# Altium schematic sheet Maxim.SchDoc
size A
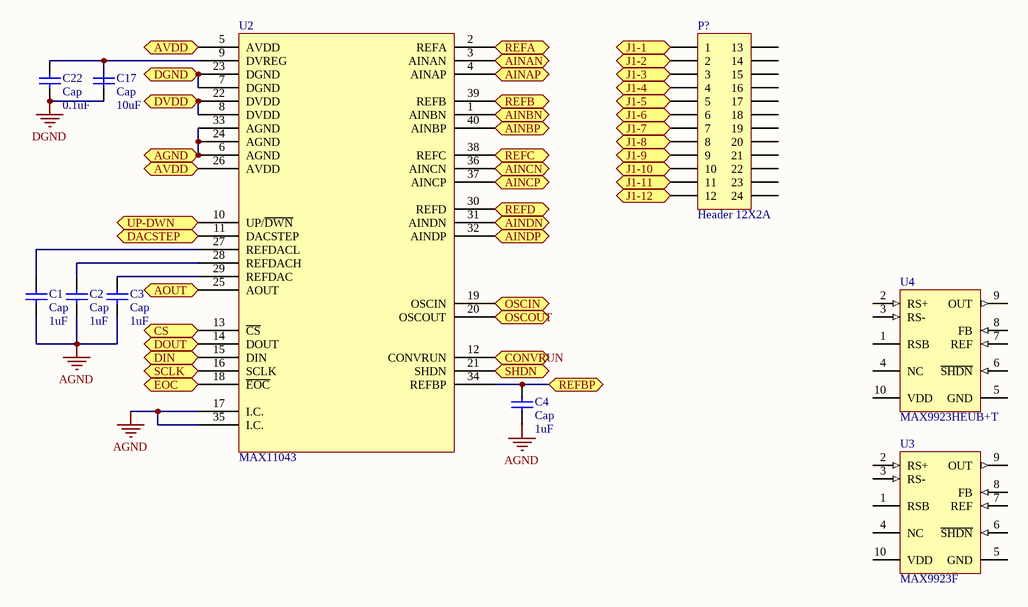
[diagram p0: Maxim.SchDoc]

## Parts
C1  Cap  value 1uF  [RAD-0.3]
C2  Cap  value 1uF  [RAD-0.3]
C3  Cap  value 1uF  [RAD-0.3]
C4  Cap  value 1uF  [RAD-0.3]
C17  Cap  value 10uF  [RAD-0.3]
C22  Cap  value 0.1uF  [RAD-0.3]
P?  Header 12X2A  [HDR2X12_CEN]
U2  MAX11043
U3  MAX9923F  [MAXM-U10+2_N]
U4  MAX9923HEUB+T  [MAXM-U10+2_N]

## Ports
AGND, AINAN, AINAP, AINBN, AINBP, AINCN, AINCP, AINDN, AINDP, AOUT, AVDD, CONVRUN, CS, DACSTEP, DGND, DIN, DOUT, DVDD, EOC, J1-1, J1-2, J1-3, J1-4, J1-5, J1-6, J1-7, J1-8, J1-9, J1-10, J1-11, J1-12, OSCIN, OSCOUT, REFA, REFB, REFBP, REFC, REFD, SCLK, SHDN, UP-DWN

## Nets
AGND: C1.1 C2.2 C3.1 C4.2 U2.17(I.C.) U2.35(I.C.)
DGND: C17.2 C22.2
AGND: U2.6(AGND) U2.24(AGND) U2.33(AGND) ; port AGND  [a separate net that carries the same name]
AINAN: U2.3(AINAN) ; port AINAN
AINAP: U2.4(AINAP) ; port AINAP
AINBN: U2.1(AINBN) ; port AINBN
AINBP: U2.40(AINBP) ; port AINBP
AINCN: U2.36(AINCN) ; port AINCN
AINCP: U2.37(AINCP) ; port AINCP
AINDN: U2.31(AINDN) ; port AINDN
AINDP: U2.32(AINDP) ; port AINDP
AOUT: U2.25(AOUT) ; port AOUT
AVDD: U2.5(AVDD) U2.26(AVDD) ; port AVDD
CONVRUN: U2.12(CONVRUN) ; port CONVRUN
CS: U2.13(~{CS}) ; port CS
DACSTEP: U2.11(DACSTEP) ; port DACSTEP
DGND: U2.7(DGND) U2.23(DGND) ; port DGND  [a separate net that carries the same name]
DIN: U2.15(DIN) ; port DIN
DOUT: U2.14(DOUT) ; port DOUT
DVDD: U2.8(DVDD) U2.22(DVDD) ; port DVDD
EOC: U2.18(~{EOC}) ; port EOC
J1-1: P?.1 ; port J1-1
J1-2: P?.2 ; port J1-2
J1-3: P?.3 ; port J1-3
J1-4: P?.4 ; port J1-4
J1-5: P?.5 ; port J1-5
J1-6: P?.6 ; port J1-6
J1-7: P?.7 ; port J1-7
J1-8: P?.8 ; port J1-8
J1-9: P?.9 ; port J1-9
J1-10: P?.10 ; port J1-10
J1-11: P?.11 ; port J1-11
J1-12: P?.12 ; port J1-12
OSCIN: U2.19(OSCIN) ; port OSCIN
OSCOUT: U2.20(OSCOUT) ; port OSCOUT
REFA: U2.2(REFA) ; port REFA
REFB: U2.39(REFB) ; port REFB
REFBP: C4.1 U2.34(REFBP) ; port REFBP
REFC: U2.38(REFC) ; port REFC
REFD: U2.30(REFD) ; port REFD
SCLK: U2.16(SCLK) ; port SCLK
SHDN: U2.21(SHDN) ; port SHDN
UP-DWN: U2.10(UP/~{DWN}) ; port UP-DWN
NetC1_2: C1.2 U2.27(REFDACL)
NetC2_1: C2.1 U2.28(REFDACH)
NetC3_2: C3.2 U2.29(REFDAC)
NetC17_1: C17.1 C22.1 U2.9(DVREG)

Not connected (* = marked no-connect by the designer): P? 13 14 15 16 17 18 19 20 21 22 23 24; U3 1(RSB) 2(RS+) 3(RS-) 4(NC) 5(GND) 6(~{SHDN}) 7(REF) 8(FB) 9(OUT) 10(VDD); U4 1(RSB) 2(RS+) 3(RS-) 4(NC) 5(GND) 6(~{SHDN}) 7(REF) 8(FB) 9(OUT) 10(VDD)

## Library data of the parts
C1-C4 C17 C22 = Cap: Capacitor; Published: 8-Jun-2000; LatestRevisionDate: 17-Jul-2002; LatestRevisionNote: Re-released for DXP Platform.; PackageReference: RAD-0.3; Publisher: Altium Limited; PackageDescription: Radial Cap, Thru-Hole; 2 Leads; 0.3 in Pin Spacing
P? = Header 12X2A: Header, 12-Pin, Dual row; LatestRevisionDate: 17-Jul-2002; LatestRevisionNote: Re-released for DXP Platform.; Publisher: Altium Limited
U3 = CMP-0252-00092-1: Ultra-Precision, High-Side Current-Sense Amplifier with Fixed Gain, 100 V / V Gain, -40 to 85 degC, 10-Pin SOP (U10+2), Pb-Free, Tape and Reel; PartNumber: MAX9923HEUB+T; Gain: 25 V/V, 100 V/V ,250 V/V; Bi-Dir. Curr. Sense: Yes; ComponentLink3Description: Package Specification; ComponentLink2Description: Datasheet; ComponentLink1Description: Manufacturer URL; ComponentLink3URL: http://pdfserv.maximintegrated.com/package_dwgs/21-0061.PDF; PackageReference: U10+2; PackageDescription: 10-Pin Micro-MAX, Thin Shrink Small-Outline (U10+2), Body 3 x 3 mm, Pitch 0.5 mm; PackageVersion: Rev. L, 07/2008; Mounting Technology: Surface Mount; ComponentLink2URL: http://datasheets.maximintegrated.com/en/ds/MAX9922-MAX9923.pdf; ComponentLink1URL: http://www.maximintegrated.com/; Code_JEDEC: MO-187; DatasheetVersion: Rev. 1
U4 = CMP-0252-00092-1: Ultra-Precision, High-Side Current-Sense Amplifier with Fixed Gain, 100 V / V Gain, -40 to 85 degC, 10-Pin SOP (U10+2), Pb-Free, Tape and Reel; Gain: 25 V/V, 100 V/V ,250 V/V; Bi-Dir. Curr. Sense: Yes; PartNumber: MAX9923HEUB+T; ComponentLink3Description: Package Specification; ComponentLink2Description: Datasheet; ComponentLink1Description: Manufacturer URL; ComponentLink3URL: http://pdfserv.maximintegrated.com/package_dwgs/21-0061.PDF; PackageReference: U10+2; PackageDescription: 10-Pin Micro-MAX, Thin Shrink Small-Outline (U10+2), Body 3 x 3 mm, Pitch 0.5 mm; PackageVersion: Rev. L, 07/2008; Mounting Technology: Surface Mount; ComponentLink2URL: http://datasheets.maximintegrated.com/en/ds/MAX9922-MAX9923.pdf; ComponentLink1URL: http://www.maximintegrated.com/; Code_JEDEC: MO-187; DatasheetVersion: Rev. 1